# Altium schematic sheet Server SoC II.schdoc
size 482 x 243 mm
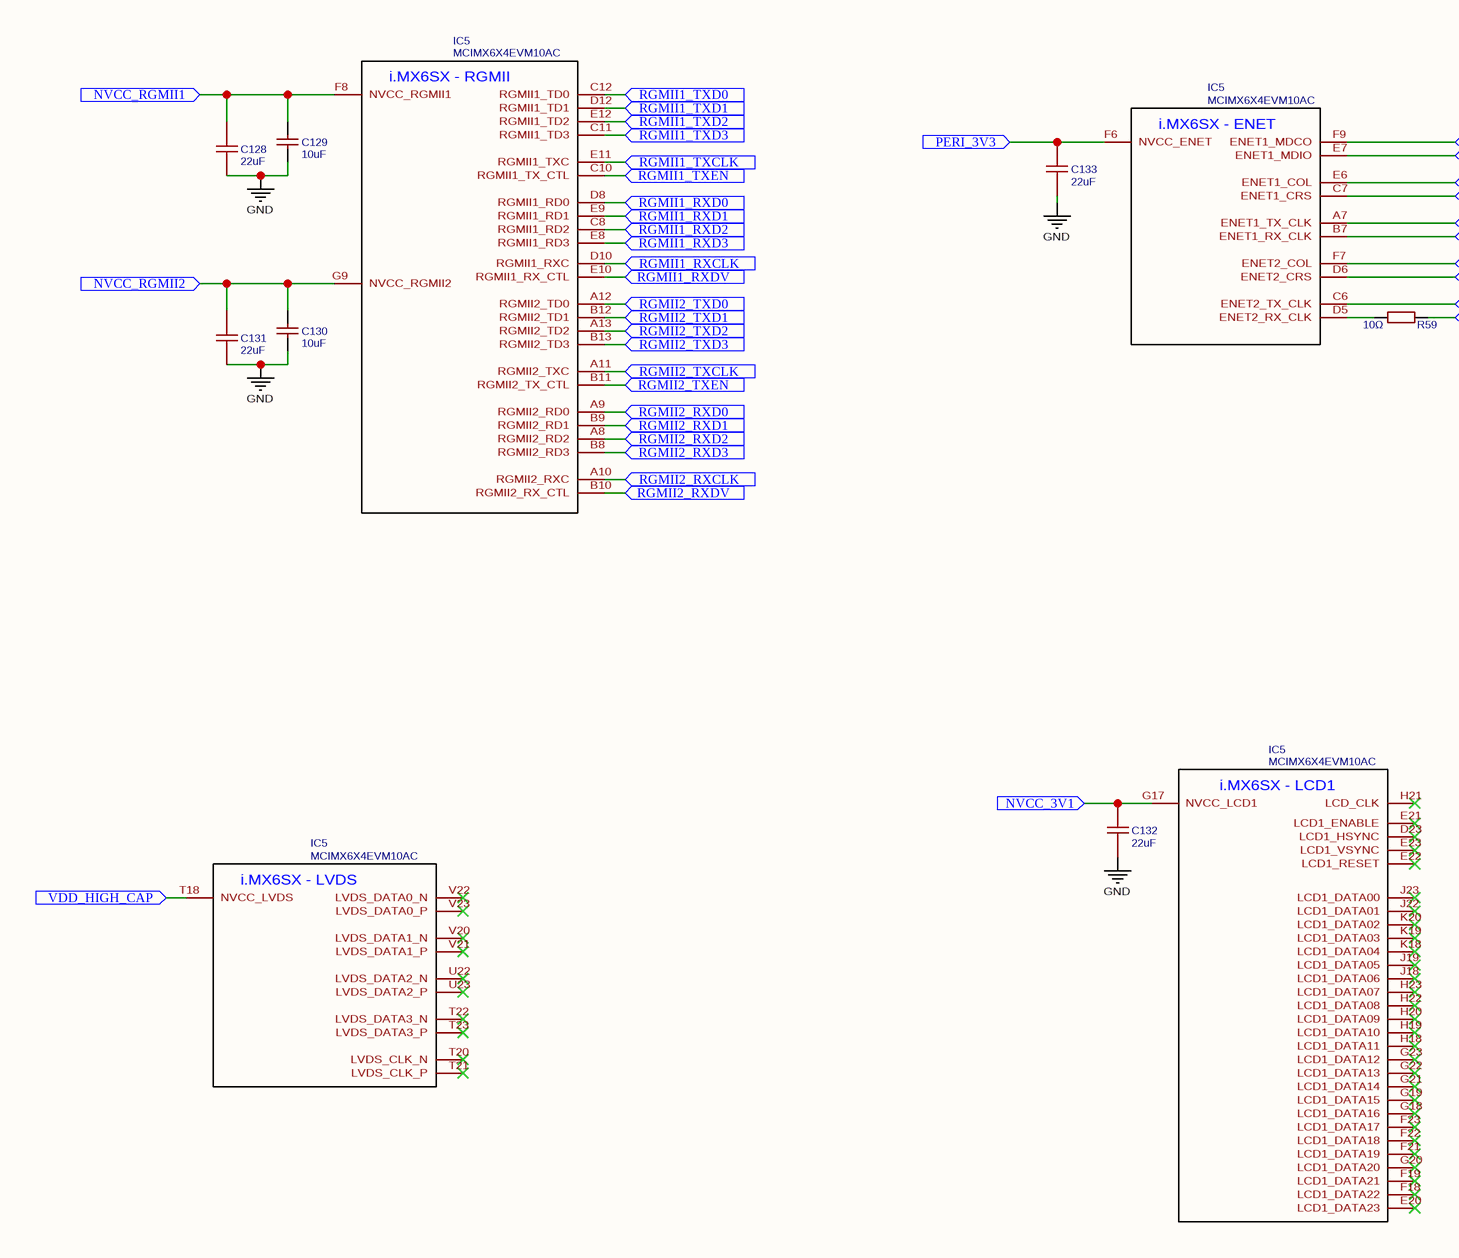
[diagram p0: Server SoC II.schdoc, left]
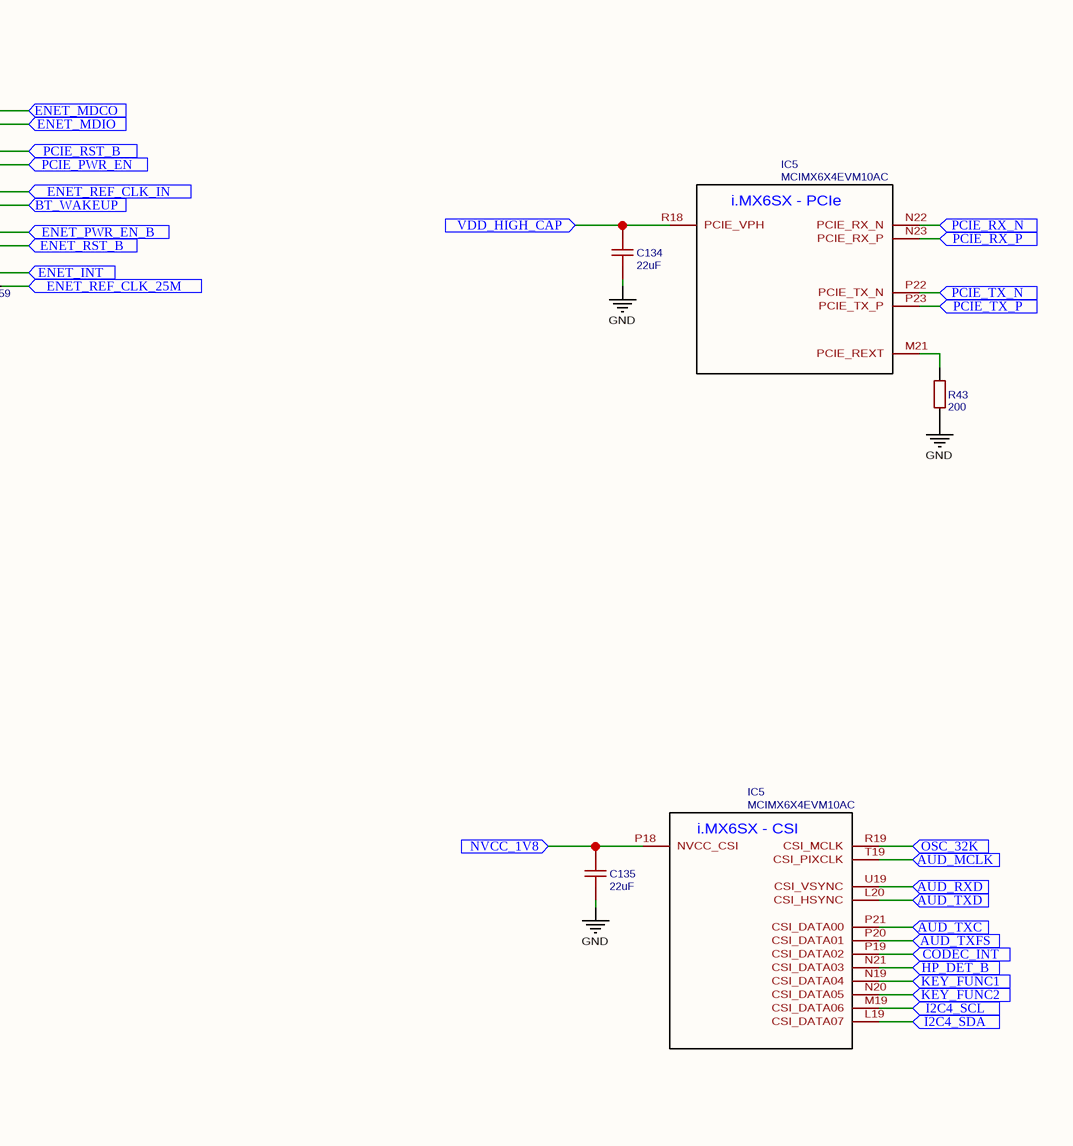
[diagram p1: Server SoC II.schdoc, right]

## Parts
(Parts that share a designator on the sheet are numbered #1, #2 ... from top to bottom, then left to right.)
C128  22uF  [C0603]
C129  10uF  [C0402]
C130  10uF  [C0402]
C131  22uF  [C0603]
C132  22uF  [C0603]
C133  22uF  [C0603]
C134  22uF  [C0603]
C135  22uF  [C0603]
IC5#1  MCIMX6X4EVM10AC  [BGA529C80P23X23_1900X1900X152]
IC5#2  MCIMX6X4EVM10AC  [BGA529C80P23X23_1900X1900X152]
IC5#3  MCIMX6X4EVM10AC  [BGA529C80P23X23_1900X1900X152]
IC5#4  MCIMX6X4EVM10AC  [BGA529C80P23X23_1900X1900X152]
IC5#5  MCIMX6X4EVM10AC  [BGA529C80P23X23_1900X1900X152]
IC5#6  MCIMX6X4EVM10AC  [BGA529C80P23X23_1900X1900X152]
R43  200  [R0603]
R59  10Ω  [R0603]

## Ports
AUD_MCLK (in), AUD_RXD (in), AUD_TXC (in), AUD_TXD (in), AUD_TXFS (in), BT_WAKEUP (in), CODEC_INT (in), ENET_INT (in), ENET_MDCO (in), ENET_MDIO (in), ENET_PWR_EN_B (in), ENET_REF_CLK_25M (in), ENET_REF_CLK_IN (in), ENET_RST_B (in), HP_DET_B (in), I2C4_SCL (in), I2C4_SDA (in), KEY_FUNC1 (in), KEY_FUNC2 (in), NVCC_1V8 (in), NVCC_3V1 (in), NVCC_RGMII1 (in), NVCC_RGMII2 (in), OSC_32K (in), PCIE_PWR_EN (in), PCIE_RST_B (in), PCIE_RX_N (in), PCIE_RX_P (in), PCIE_TX_N (in), PCIE_TX_P (in), PERI_3V3 (in), RGMII1_RXCLK (in), RGMII1_RXD0 (in), RGMII1_RXD1 (in), RGMII1_RXD2 (in), RGMII1_RXD3 (in), RGMII1_RXDV (in), RGMII1_TXCLK (in), RGMII1_TXD0 (in), RGMII1_TXD1 (in), RGMII1_TXD2 (in), RGMII1_TXD3 (in), RGMII1_TXEN (in), RGMII2_RXCLK (in), RGMII2_RXD0 (in), RGMII2_RXD1 (in), RGMII2_RXD2 (in), RGMII2_RXD3 (in), RGMII2_RXDV (in), RGMII2_TXCLK (in), RGMII2_TXD0 (in), RGMII2_TXD1 (in), RGMII2_TXD2 (in), RGMII2_TXD3 (in), RGMII2_TXEN (in), VDD_HIGH_CAP (in)

## Nets
GND: C128.1 C129.1 C130.1 C131.1 C132.1 C133.1 C134.1 C135.1 R43.1
AUD_MCLK: IC5#5.T19(CSI_PIXCLK) ; port AUD_MCLK
AUD_RXD: IC5#5.U19(CSI_VSYNC) ; port AUD_RXD
AUD_TXC: IC5#5.P21(CSI_DATA00) ; port AUD_TXC
AUD_TXD: IC5#5.L20(CSI_HSYNC) ; port AUD_TXD
AUD_TXFS: IC5#5.P20(CSI_DATA01) ; port AUD_TXFS
BT_WAKEUP: IC5#2.B7(ENET1_RX_CLK) ; port BT_WAKEUP
CODEC_INT: IC5#5.P19(CSI_DATA02) ; port CODEC_INT
ENET_INT: IC5#2.C6(ENET2_TX_CLK) ; port ENET_INT
ENET_MDCO: IC5#2.F9(ENET1_MDCO) ; port ENET_MDCO
ENET_MDIO: IC5#2.E7(ENET1_MDIO) ; port ENET_MDIO
ENET_PWR_EN_B: IC5#2.F7(ENET2_COL) ; port ENET_PWR_EN_B
ENET_REF_CLK_25M: R59.2 ; port ENET_REF_CLK_25M
ENET_REF_CLK_IN: IC5#2.A7(ENET1_TX_CLK) ; port ENET_REF_CLK_IN
ENET_RST_B: IC5#2.D6(ENET2_CRS) ; port ENET_RST_B
HP_DET_B: IC5#5.N21(CSI_DATA03) ; port HP_DET_B
I2C4_SCL: IC5#5.M19(CSI_DATA06) ; port I2C4_SCL
I2C4_SDA: IC5#5.L19(CSI_DATA07) ; port I2C4_SDA
KEY_FUNC1: IC5#5.N19(CSI_DATA04) ; port KEY_FUNC1
KEY_FUNC2: IC5#5.N20(CSI_DATA05) ; port KEY_FUNC2
NVCC_1V8: C135.2 IC5#5.P18(NVCC_CSI) ; port NVCC_1V8
NVCC_3V1: C132.2 IC5#6.G17(NVCC_LCD1) ; port NVCC_3V1
NVCC_RGMII1: C128.2 C129.2 IC5#3.F8(NVCC_RGMII1) ; port NVCC_RGMII1
NVCC_RGMII2: C130.2 C131.2 IC5#3.G9(NVCC_RGMII2) ; port NVCC_RGMII2
OSC_32K: IC5#5.R19(CSI_MCLK) ; port OSC_32K
PCIE_PWR_EN: IC5#2.C7(ENET1_CRS) ; port PCIE_PWR_EN
PCIE_RST_B: IC5#2.E6(ENET1_COL) ; port PCIE_RST_B
PCIE_RX_N: IC5#1.N22(PCIE_RX_N) ; port PCIE_RX_N
PCIE_RX_P: IC5#1.N23(PCIE_RX_P) ; port PCIE_RX_P
PCIE_TX_N: IC5#1.P22(PCIE_TX_N) ; port PCIE_TX_N
PCIE_TX_P: IC5#1.P23(PCIE_TX_P) ; port PCIE_TX_P
PERI_3V3: C133.2 IC5#2.F6(NVCC_ENET) ; port PERI_3V3
RGMII1_RXCLK: IC5#3.D10(RGMII1_RXC) ; port RGMII1_RXCLK
RGMII1_RXD0: IC5#3.D8(RGMII1_RD0) ; port RGMII1_RXD0
RGMII1_RXD1: IC5#3.E9(RGMII1_RD1) ; port RGMII1_RXD1
RGMII1_RXD2: IC5#3.C8(RGMII1_RD2) ; port RGMII1_RXD2
RGMII1_RXD3: IC5#3.E8(RGMII1_RD3) ; port RGMII1_RXD3
RGMII1_RXDV: IC5#3.E10(RGMII1_RX_CTL) ; port RGMII1_RXDV
RGMII1_TXCLK: IC5#3.E11(RGMII1_TXC) ; port RGMII1_TXCLK
RGMII1_TXD0: IC5#3.C12(RGMII1_TD0) ; port RGMII1_TXD0
RGMII1_TXD1: IC5#3.D12(RGMII1_TD1) ; port RGMII1_TXD1
RGMII1_TXD2: IC5#3.E12(RGMII1_TD2) ; port RGMII1_TXD2
RGMII1_TXD3: IC5#3.C11(RGMII1_TD3) ; port RGMII1_TXD3
RGMII1_TXEN: IC5#3.C10(RGMII1_TX_CTL) ; port RGMII1_TXEN
RGMII2_RXCLK: IC5#3.A10(RGMII2_RXC) ; port RGMII2_RXCLK
RGMII2_RXD0: IC5#3.A9(RGMII2_RD0) ; port RGMII2_RXD0
RGMII2_RXD1: IC5#3.B9(RGMII2_RD1) ; port RGMII2_RXD1
RGMII2_RXD2: IC5#3.A8(RGMII2_RD2) ; port RGMII2_RXD2
RGMII2_RXD3: IC5#3.B8(RGMII2_RD3) ; port RGMII2_RXD3
RGMII2_RXDV: IC5#3.B10(RGMII2_RX_CTL) ; port RGMII2_RXDV
RGMII2_TXCLK: IC5#3.A11(RGMII2_TXC) ; port RGMII2_TXCLK
RGMII2_TXD0: IC5#3.A12(RGMII2_TD0) ; port RGMII2_TXD0
RGMII2_TXD1: IC5#3.B12(RGMII2_TD1) ; port RGMII2_TXD1
RGMII2_TXD2: IC5#3.A13(RGMII2_TD2) ; port RGMII2_TXD2
RGMII2_TXD3: IC5#3.B13(RGMII2_TD3) ; port RGMII2_TXD3
RGMII2_TXEN: IC5#3.B11(RGMII2_TX_CTL) ; port RGMII2_TXEN
VDD_HIGH_CAP: C134.2 IC5#1.R18(PCIE_VPH) IC5#4.T18(NVCC_LVDS) ; port VDD_HIGH_CAP
NetIC5#1_M21: IC5#1.M21(PCIE_REXT) R43.2
NetIC5#2_D5: IC5#2.D5(ENET2_RX_CLK) R59.1

Not connected (* = marked no-connect by the designer): IC5#4 T20(LVDS_CLK_N)* T21(LVDS_CLK_P)* T22(LVDS_DATA3_N)* T23(LVDS_DATA3_P)* U22(LVDS_DATA2_N)* U23(LVDS_DATA2_P)* V20(LVDS_DATA1_N)* V21(LVDS_DATA1_P)* V22(LVDS_DATA0_N)* V23(LVDS_DATA0_P)*; IC5#6 D23(LCD1_HSYNC)* E20(LCD1_DATA23)* E21(LCD1_ENABLE)* E22(LCD1_RESET)* E23(LCD1_VSYNC)* F18(LCD1_DATA22)* F19(LCD1_DATA21)* F21(LCD1_DATA19)* F22(LCD1_DATA18)* F23(LCD1_DATA17)* G18(LCD1_DATA16)* G19(LCD1_DATA15)* G20(LCD1_DATA20)* G21(LCD1_DATA14)* G22(LCD1_DATA13)* G23(LCD1_DATA12)* H18(LCD1_DATA11)* H19(LCD1_DATA10)* H20(LCD1_DATA09)* H21(LCD_CLK)* H22(LCD1_DATA08)* H23(LCD1_DATA07)* J18(LCD1_DATA06)* J19(LCD1_DATA05)* J22(LCD1_DATA01)* J23(LCD1_DATA00)* K18(LCD1_DATA04)* K19(LCD1_DATA03)* K20(LCD1_DATA02)*

## Notes on the sheet
- (in symbol MCIMX6X4EVM10AC) i.MX6SX - LCD1; i.MX6SX - CSI; i.MX6SX - LVDS; i.MX6SX - PCIe; i.MX6SX - ENET; i.MX6SX - RGMII

## Library data of the parts
C128 C131-C135 = 22uF: BOM_Manufacturer: SAMSUNG; BOM_Manufacturer Part: CL10A226MP8NUNE; nameAlias: Capacitance; SMT Type: Extend; BOM_Supplier: LCSC; BOM_Supplier Part: C86295; BOM_LCSC Assembly: Yes; spicePre: C; spiceSymbolName: CL10A226MP8NUNE
C129 C130 = 10uF: BOM_Manufacturer Part: CL05A106MQ5NUNC; BOM_Manufacturer: SAMSUNG; nameAlias: Capacitance; SMT Type: Basic; BOM_Supplier: LCSC; BOM_LCSC Assembly: Yes; BOM_Supplier Part: C15525; spicePre: C; spiceSymbolName: CL05A106MQ5NUNC
IC5#1 IC5#2 IC5#4-IC5#6 = MCIMX6X4EVM10AC: subpart_no: 1; Contributor: Ke'Ondrae_Mell; spicePre: I; spiceSymbolName: MCIMX6X4EVM10AC
IC5#3 = MCIMX6X4EVM10AC: subpart_no: 12; Contributor: Ke'Ondrae_Mell; spicePre: I; spiceSymbolName: MCIMX6X4EVM10AC
R43 = 200: BOM_Manufacturer: UniOhm; BOM_Manufacturer Part: 0603WAF2000T5E; nameAlias: Resistance (Ohms); SMT Type: Basic; BOM_Supplier: LCSC; BOM_LCSC Assembly: Yes; BOM_Supplier Part: C8218; spicePre: R; spiceSymbolName: 0603WAF2000T5E
R59 = 10Ω: BOM_Manufacturer: UniOhm; BOM_Manufacturer Part: 0603WAF100JT5E; nameAlias: Resistance (Ohms); SMT Type: Basic; BOM_Supplier: LCSC; BOM_LCSC Assembly: Yes; BOM_Supplier Part: C22859; spicePre: R; spiceSymbolName: 0603WAF100JT5E